# EAGLE design Routerv1.1 (EAGLE 8.3.1)

## Sheet 1 of 2
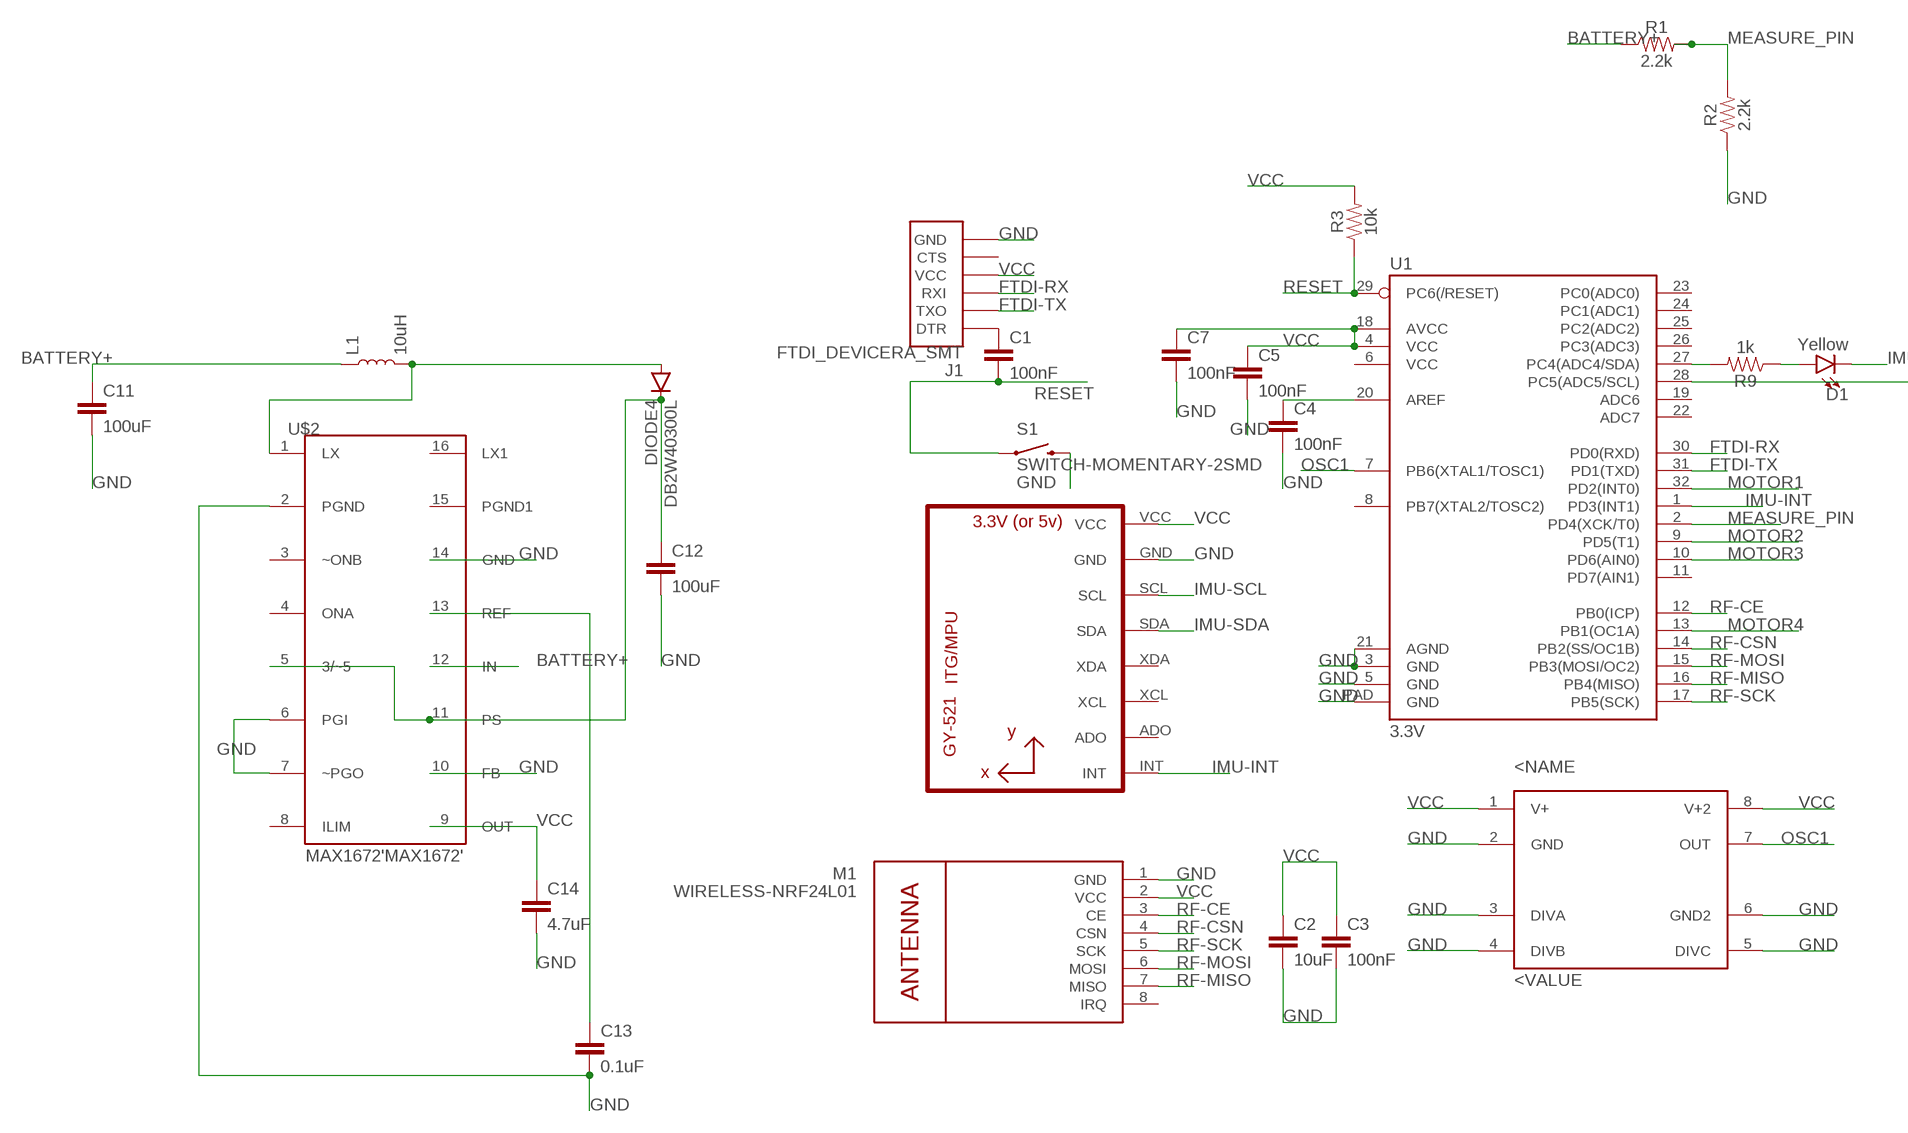
[diagram p0: schematic, sheet 1, part 1 of 2]
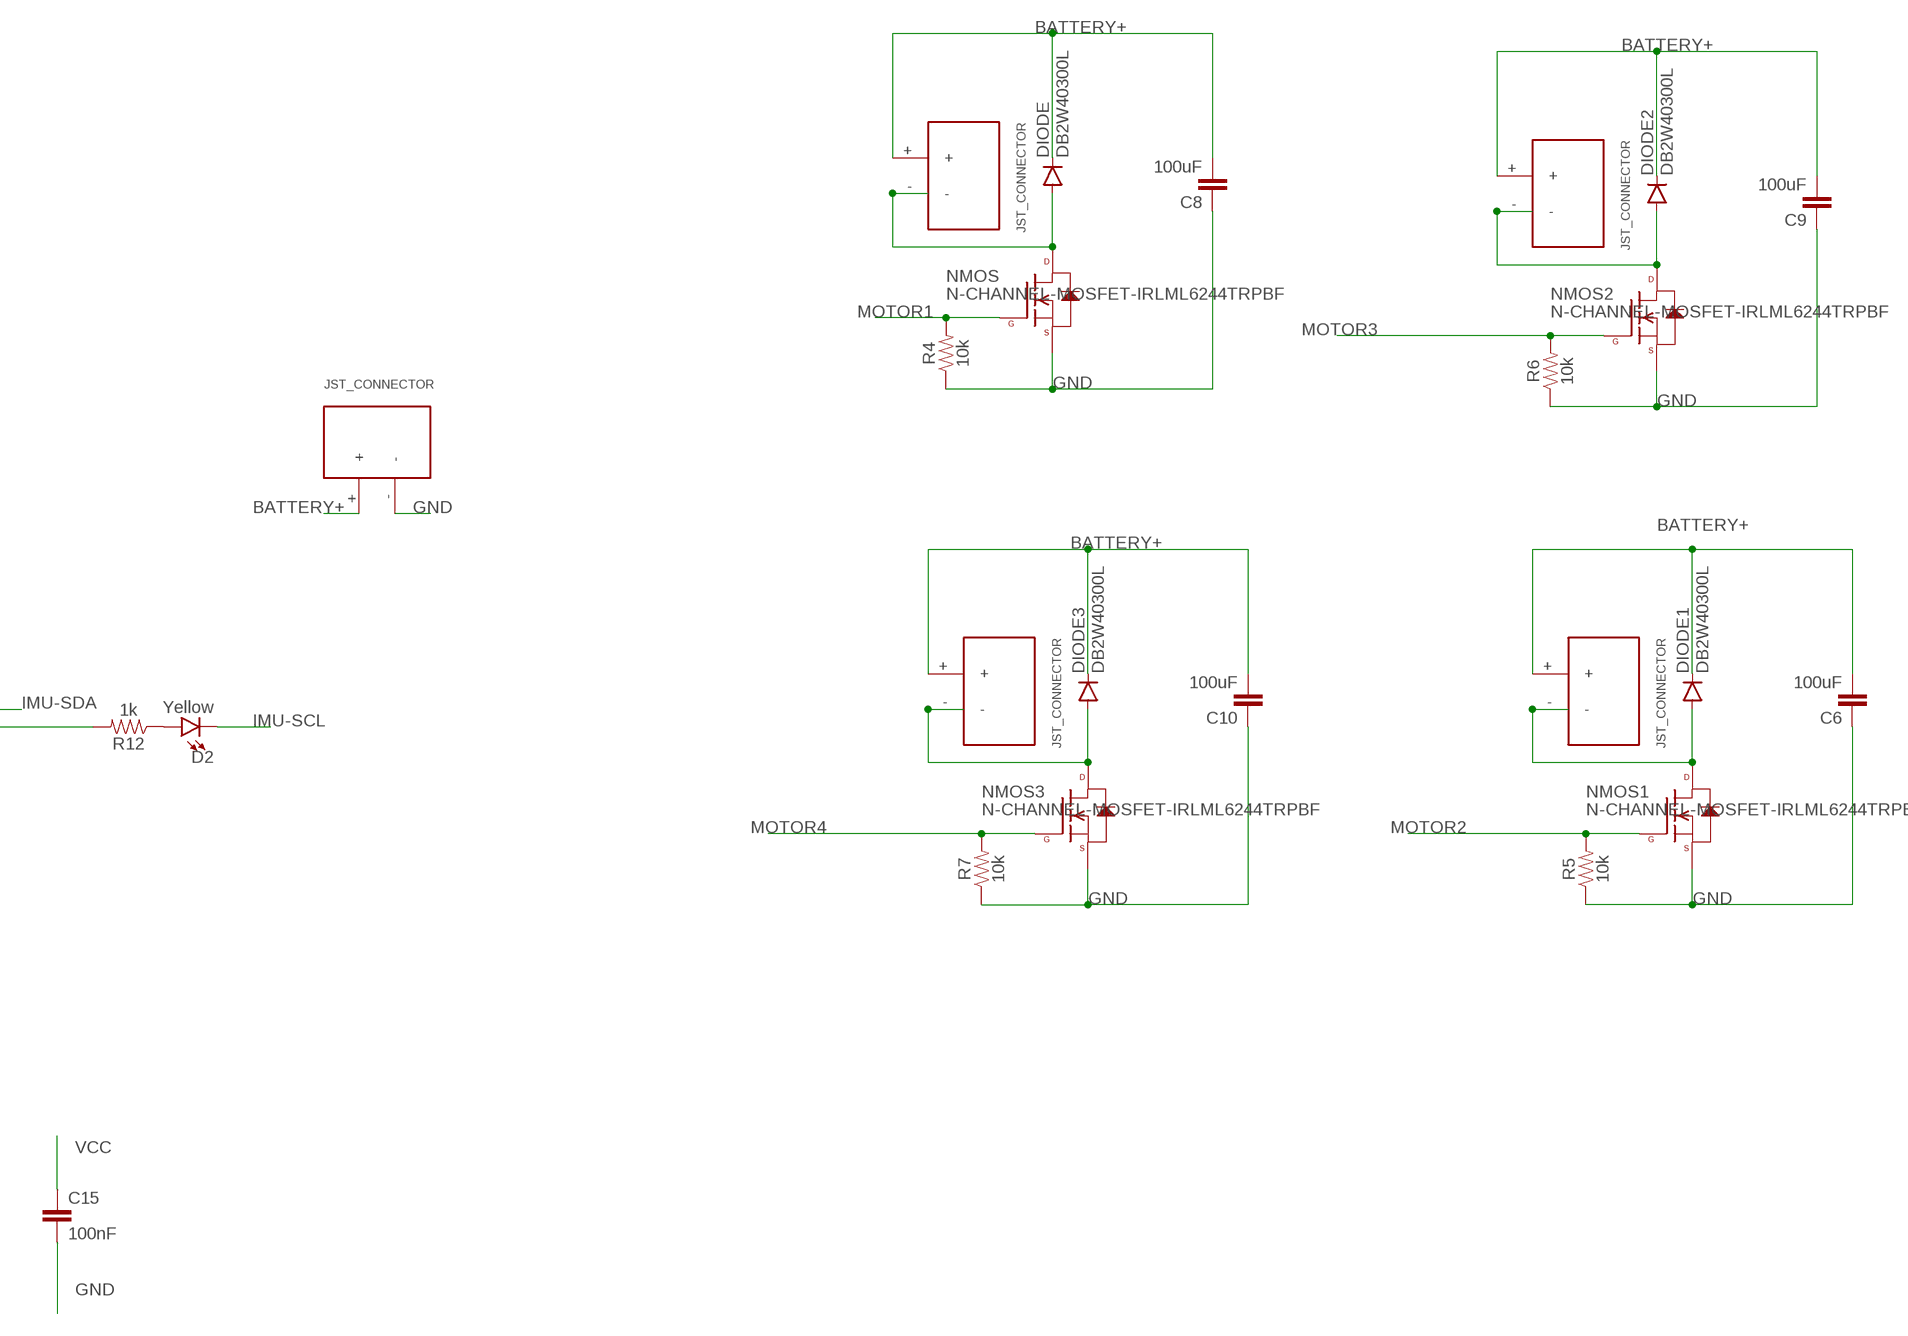
[diagram p1: schematic, sheet 1, part 2 of 2]

### Parts
C1  100nF  0.1UF-25V(+80/-20%)(0603)  [0603-CAP]
C2  10uF  CAP0603-CAP  [0603-CAP]
C3  100nF  CAP0603-CAP  [0603-CAP]
C4  100nF  CAP0603-CAP  [0603-CAP]
C5  100nF  CAP0603-CAP  [0603-CAP]
C6  100uF  CAP0603-CAP  [0603-CAP]
C7  100nF  CAP0603-CAP  [0603-CAP]
C8  100uF  CAP0603-CAP  [0603-CAP]
C9  100uF  CAP0603-CAP  [0603-CAP]
C10  100uF  CAP0603-CAP  [0603-CAP]
C11  100uF  CAP0603-CAP  [0603-CAP]
C12  100uF  CAP0603-CAP  [0603-CAP]
C13  0.1uF  CAP0603-CAP  [0603-CAP]
C14  4.7uF  CAP0603-CAP  [0603-CAP]
C15  100nF  0.1UF-25V(+80/-20%)(0603)  [0603-CAP]
D1  Yellow  LED-YELLOWLILYPAD  [LED-1206]
D2  Yellow  LED-YELLOWLILYPAD  [LED-1206]
DIODE  DB2W40300L  [MINI2-F3-B]
DIODE1  DB2W40300L  [MINI2-F3-B]
DIODE2  DB2W40300L  [MINI2-F3-B]
DIODE3  DB2W40300L  [MINI2-F3-B]
DIODE4  DB2W40300L  [MINI2-F3-B]
J1  FTDI_DEVICERA_SMT  [FTDI_DEVICE_RA_SMT]
L1  10uH  INDUCTOR-0603-33NH  [0603]
M1  WIRELESS-NRF24L01  [WIRELESS-NRF24L01]
MOTOR  JST_CONNECTOR_FEMALE  [JST_CONNECTOR_FEMALE]
MOTOR1  JST_CONNECTOR_FEMALE  [JST_CONNECTOR_FEMALE]
MOTOR2  JST_CONNECTOR_FEMALE  [JST_CONNECTOR_FEMALE]
MOTOR3  JST_CONNECTOR_FEMALE  [JST_CONNECTOR_FEMALE]
NMOS  N-CHANNEL-MOSFET-IRLML6244TRPBF  [SOT23-3]
NMOS1  N-CHANNEL-MOSFET-IRLML6244TRPBF  [SOT23-3]
NMOS2  N-CHANNEL-MOSFET-IRLML6244TRPBF  [SOT23-3]
NMOS3  N-CHANNEL-MOSFET-IRLML6244TRPBF  [SOT23-3]
R1  2.2k  2.2KOHM-0603-1/10W-1%  [0603]
R2  2.2k  2.2KOHM-0603-1/10W-1%  [0603]
R3  10k  2.2KOHM-0603-1/10W-1%  [0603]
R4  10k  2.2KOHM-0603-1/10W-1%  [0603]
R5  10k  2.2KOHM-0603-1/10W-1%  [0603]
R6  10k  2.2KOHM-0603-1/10W-1%  [0603]
R7  10k  2.2KOHM-0603-1/10W-1%  [0603]
R9  1k  2.2KOHM-0603-1/10W-1%  [0603]
R12  1k  2.2KOHM-0603-1/10W-1%  [0603]
S1  SWITCH-MOMENTARY-2SMD  [TACTILE-SWITCH-SMD]
U1  3.3V  ATMEGA328P_MLFMLF32  [MLF32-PAD]
U2  GY-521MPU6050  [GY-521]
U$1  JST_CONNECTOR_FEMALE  [JST_CONNECTOR_FEMALE]
U$2  MAX1672'MAX1672'  [21-0055H_16]
U$3  LTC6930CMS8-8.19LTC6930CMS8-8.19  [SOP65P490X110-8N]

### Nets
BATTERY+: C6.2 C8.2 C9.2 C10.2 C11.1 DIODE1.NEG(GPIN) DIODE2.NEG(GPIN) DIODE3.NEG(GPIN) DIODE.NEG(GPIN) L1.1 MOTOR1.+ MOTOR2.+ MOTOR3.+ MOTOR.+ R1.1 U$1.+ U$2.12(IN)
FTDI-RX: J1.3(RXI) U1.30(PD0(RXD))
FTDI-TX: J1.2(TXO) U1.31(PD1(TXD))
GND: C2.2 C3.2 C4.2 C5.2 C6.1 C7.2 C8.1 C9.1 C10.1 C11.2 C12.2 C13.2 C14.2 C15.2 J1.6(GND) M1.1(GND) NMOS1.2(S) NMOS2.2(S) NMOS3.2(S) NMOS.2(S) R2.1 R4.1 R5.1 R6.1 R7.1 S1.3 U1.3(GND) U1.5(GND) U1.21(AGND) U1.PAD(GND) U2.GND U$1.- U$2.2(PGND) U$2.6(PGI) U$2.7(~PGO) U$2.10(FB) U$2.14(GND) U$3.2(GND) U$3.3(DIVA) U$3.4(DIVB) U$3.5(DIVC) U$3.6(GND2)
IMU-INT: U1.1(PD3(INT1)) U2.INT
IMU-SCL: D2.C U2.SCL
IMU-SDA: D1.C U2.SDA
MEASURE_PIN: R1.2 R2.2 U1.2(PD4(XCK/T0))
MOTOR1: NMOS.1(G) R4.2 U1.32(PD2(INT0))
MOTOR2: NMOS1.1(G) R5.2 U1.9(PD5(T1))
MOTOR3: NMOS2.1(G) R6.2 U1.10(PD6(AIN0))
MOTOR4: NMOS3.1(G) R7.2 U1.13(PB1(OC1A))
N$1: DIODE4.POS(PPIN) L1.2 U$2.1(LX)
N$2: C4.1 U1.20(AREF)
N$3: R9.2 U1.27(PC4(ADC4/SDA))
N$4: DIODE1.POS(PPIN) MOTOR1.- NMOS1.3(D)
N$5: DIODE2.POS(PPIN) MOTOR2.- NMOS2.3(D)
N$6: DIODE.POS(PPIN) MOTOR.- NMOS.3(D)
N$7: DIODE3.POS(PPIN) MOTOR3.- NMOS3.3(D)
N$8: D1.A R9.1
N$9: D2.A R12.1
N$10: R12.2 U1.28(PC5(ADC5/SCL))
N$13: C1.1 J1.1(DTR)
OSC1: U1.7(PB6(XTAL1/TOSC1)) U$3.7(OUT)
RESET: C1.2 R3.1 S1.1 U1.29(PC6(/RESET))
RF-CE: M1.3(CE) U1.12(PB0(ICP))
RF-CSN: M1.4(CSN) U1.14(PB2(SS/OC1B))
RF-MISO: M1.7(MISO) U1.16(PB4(MISO))
RF-MOSI: M1.6(MOSI) U1.15(PB3(MOSI/OC2))
RF-SCK: M1.5(SCK) U1.17(PB5(SCK))
VCC: C2.1 C3.1 C5.1 C7.1 C14.1 C15.1 J1.4(VCC) M1.2(VCC) R3.2 U1.4(VCC) U1.18(AVCC) U2.VCC U$2.9(OUT) U$3.1(V+) U$3.8(V+2)
VR-PS: C12.1 DIODE4.NEG(GPIN) U$2.5(3/~5) U$2.11(PS)
VR-REF: C13.1 U$2.13(REF)
Unconnected: J1.5(CTS) M1.8(IRQ) U1.6(VCC) U1.8(PB7(XTAL2/TOSC2)) U1.11(PD7(AIN1)) U1.19(ADC6) U1.22(ADC7) U1.23(PC0(ADC0)) U1.24(PC1(ADC1)) U1.25(PC2(ADC2)) U1.26(PC3(ADC3)) U2.ADO U2.XCL U2.XDA U$2.3(~ONB) U$2.4(ONA) U$2.8(ILIM) U$2.15(PGND1) U$2.16(LX1)

## Sheet 2 of 2

## Library data of the parts
C1 C15 = SparkFun-Capacitors:0.1UF-25V(+80/-20%)(0603): CAP-00810 Ceramic Standard decoupling cap; PROD_ID: CAP-00810; VALUE: 0.1uF
C2-C14 = SparkFun-Passives:CAP: Capacitor Standard 0603 ceramic capacitor, and 0.1" leaded capacitor.
D1 D2 = SparkFun-LED:LED-YELLOW: Yellow SMD LED Used in manufacturing several products at SparkFun. Packages: 0603 - SMD 0603 package[Product Link] <http://www.kingbrightusa.com/product.asp?catalog_name=LED&product_id=APT1608SYCK> 0603 -SMART - SMART SMD 0603 package (more efficient/more expensive) [Product Link] <http://www.osram-os.com/osram_os/en/products/product-catalog/led-light-emitting-diodes/smartled-0603/ly-l29k/index.jsp> LilyPad - SMD1206 package[Product Datasheet] <https://www.sparkfun.com/datasheets/DevTools/LilyPad/Q150YUS4.pdf> SparkFun Products: Blynk Board <https://www.sparkfun.com/products/13794> IOIO-OTG <https://www.sparkfun.com/products/13613> XBee Explorer Serial <https://www.sparkfun.com/products/13225>; PROD_ID: DIO-09909
DIODE DIODE1-DIODE4 = quad:DB2W40300L
J1 = quad:FTDI_DEVICE: Connector which mates to FTDI basic or FTDI cable.; PROD_ID: CONN-08971
L1 = SparkFun-Coils:INDUCTOR: Inductors Resist changes in electrical current. Basically a coil of wire. SparkFun Products: SparkFun Load Cell Amplifier - HX711 <https://www.sparkfun.com/products/13879> IOIO-OTG - V2.2 <https://www.sparkfun.com/products/13613>; PROD_ID: NDUC-07874; VALUE: 33nH/±5%/500mA
M1 = quad:WIRELESS-NRF24L01: 2.4 GHz Wireless Module based on NRF24L01 chip
MOTOR MOTOR1-MOTOR3 U$1 = quad:JST_CONNECTOR_FEMALE
NMOS NMOS1-NMOS3 = quad:N-CHANNEL-MOSFET: N-Channel MOSFET Mode Field Effect Transistor; DATASHEET: http://www.mouser.com/ds/2/196/irlml6244pbf-936666.pdf; MOUSER: 942-IRLML6244TRPBF; URL: http://www.mouser.com/Search/ProductDetail.aspx?R=IRLML6244TRPBFvirtualkey57370000virtualkey942-IRLML6244TRPBF
R1 R2 = SparkFun-Resistors:2.2KOHM: 2.2kΩ resistor A resistor is a passive two-terminal electrical component that implements electrical resistance as a circuit element. Resistors act to reduce current flow, and, at the same time, act to lower voltage levels within circuits. - Wikipedia; PROD_ID: RES-08272
R3-R7 R9 R12 = SparkFun-Resistors:2.2KOHM: 2.2kΩ resistor A resistor is a passive two-terminal electrical component that implements electrical resistance as a circuit element. Resistors act to reduce current flow, and, at the same time, act to lower voltage levels within circuits. - Wikipedia; PROD_ID: RES-08272; VALUE: 2.2k
S1 = quad:SWITCH-MOMENTARY-2: Various NO switches- pushbuttons, reed, etc; PROD_ID: SWCH-08247
U1 = SparkFun-DigitalIC:ATMEGA328P_MLF: 32-Pin Atmega328 part Commonly used on Arduino compatible boards Available in QFP and QFN packages TQFP is IC-09069 QFN is non-stock
U2 = quad:GY-521
U$2 = voltreg:MAX1672
U$3 = LTC6390:LTC6930CMS8-8.19

## Net classes
1 BATTERY_+: width 0.762 mm
2 VCC: width 0.762 mm
3 GND: width 0.762 mm

## Board
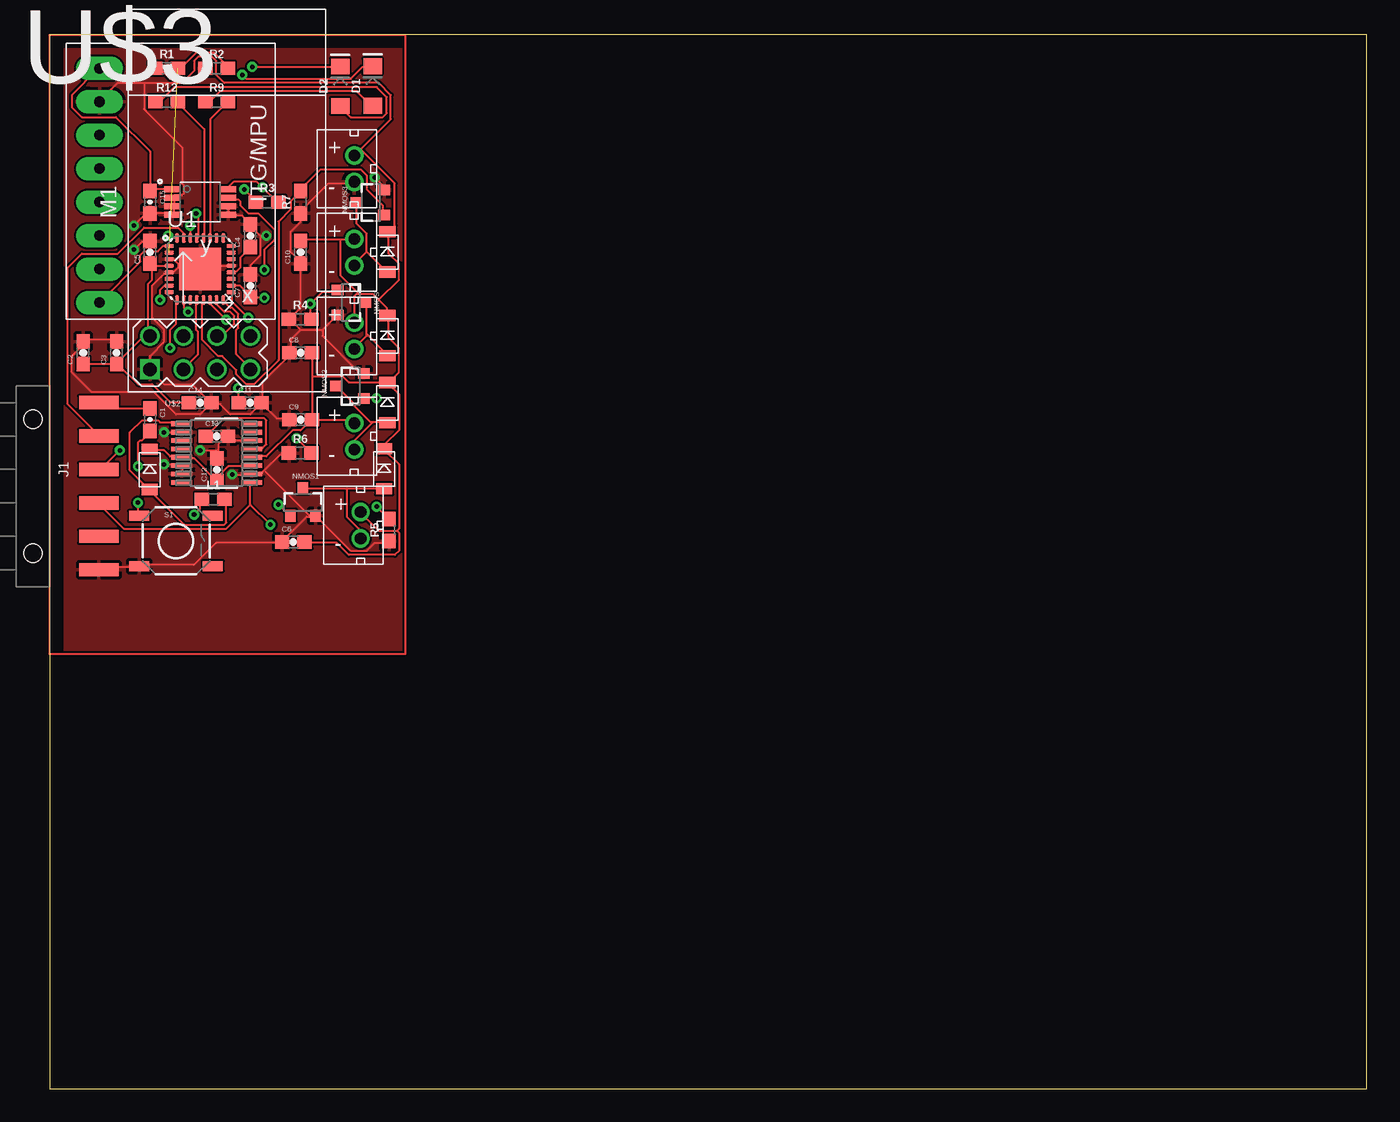
[diagram p2: board, top side]
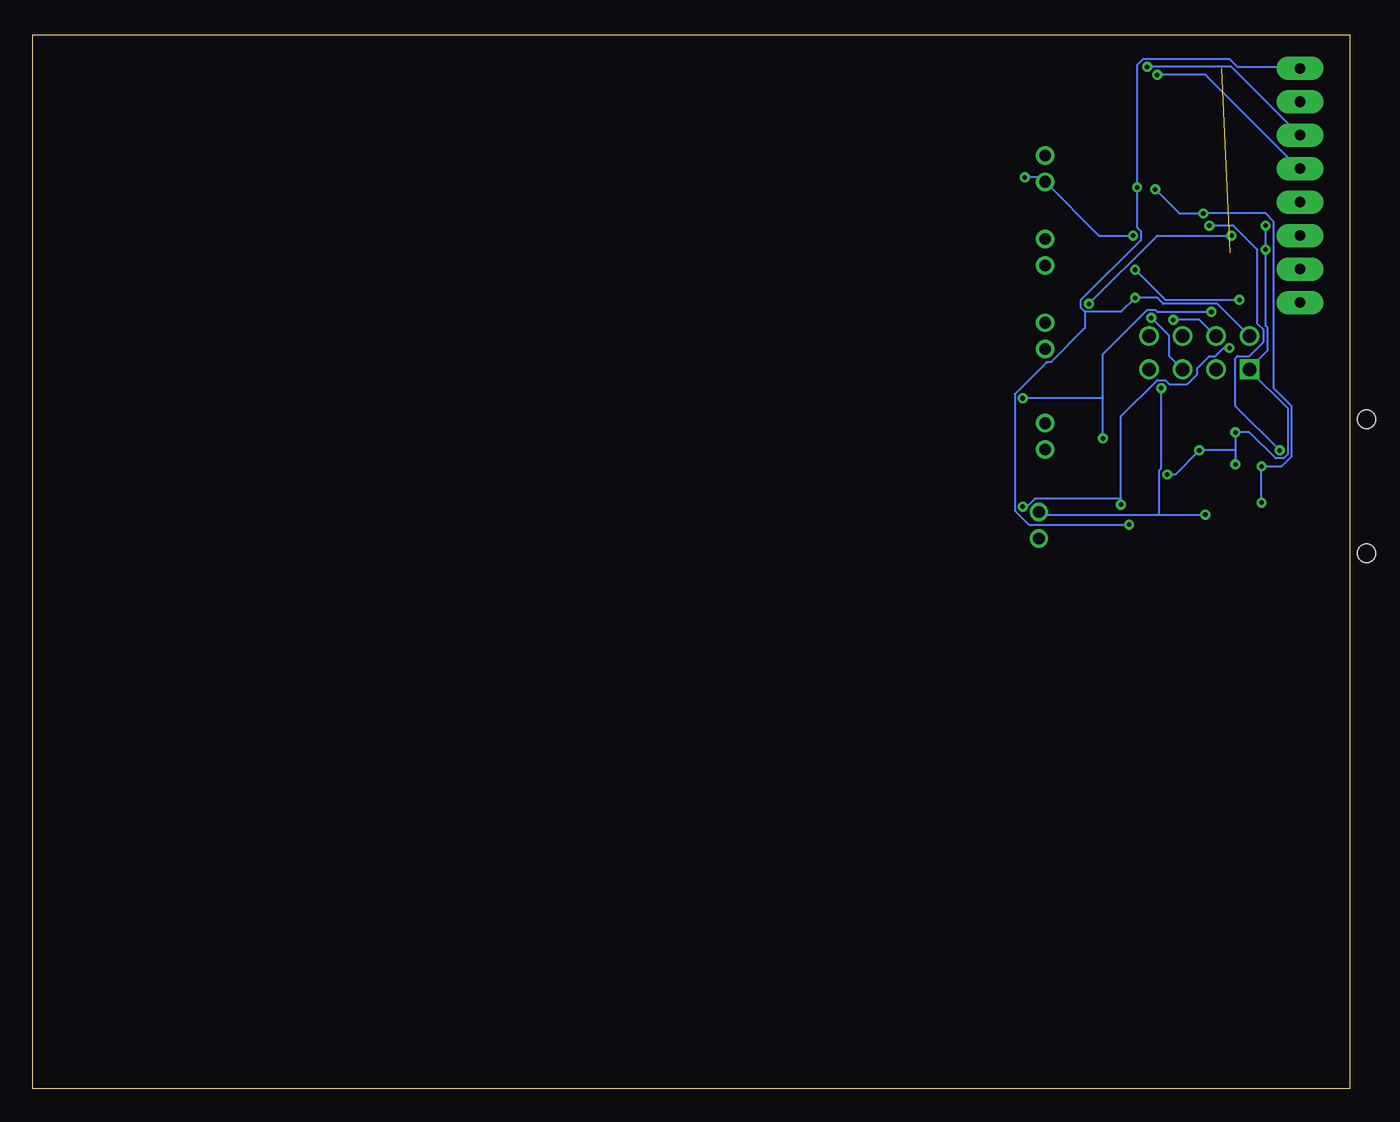
[diagram p3: board, bottom side, seen from below]

Size 100 x 80 mm. Coordinates in mm from the lower left corner, seen from the top.
Outline: 0,0 100,0 100,80 0,80 0,0
Copper layers (1*16): Top 0.035mm / dielectric 1.5mm / Bottom 0.035mm
Design rules "default": minimum track width 6mil, minimum drill 0.35mm, track to track 6mil, track to pad 6mil, pad to pad 6mil, via to via 6mil, smd to smd 6mil, copper to edge 40mil, drill to drill 6mil, minimum pad ring 10mil, minimum via ring 8mil, stop-mask expansion 4mil, vias tented up to drill 0mil, thermal gap 10mil

### Footprints (pad centres in the part's own frame; a part is rotated, then mirrored left to right if it is on the bottom)
0603-CAP = smd 1.1 x 1: 1 -0.85,0; 2 0.85,0
LED-1206 = smd 1.2 x 1.4: A -1.5,0; C 1.5,0
MINI2-F3-B = smd 1.22 x 0.85: NEG 0,1.55; POS 0,-1.5
FTDI_DEVICE_RA_SMT = smd 1 x 3: 1 -6.35,5; 2 -3.81,5; 3 -1.27,5; 4 1.27,5; 5 3.81,5; 6 6.35,5 | hole 1.4: -5.08,0; 5.08,0
0603 = smd 1.1 x 1: 1 -0.85,0; 2 0.85,0
WIRELESS-NRF24L01 = drill 1 square: 1 -12.7,6.35 | drill 1: 2 -10.16,6.35; 3 -12.7,3.81; 4 -10.16,3.81; 5 -12.7,1.27; 6 -10.16,1.27; 7 -12.7,-1.27; 8 -10.16,-1.27
JST_CONNECTOR_FEMALE = drill 0.889: + 0,1; - 0,-1
SOT23-3 = smd 0.8 x 0.9: 1 -0.95,-1; 2 0.95,-1; 3 0,1.1
TACTILE-SWITCH-SMD = smd 1.524 x 0.762: 1 -2.794,1.905; 2 2.794,1.905; 3 -2.794,-1.905; 4 2.794,-1.905
MLF32-PAD = smd 0.7 x 0.3: 1 -2.35,1.75; 2 -2.35,1.25; 3 -2.35,0.75; 4 -2.35,0.25; 5 -2.35,-0.25; 6 -2.35,-0.75; 7 -2.35,-1.25; 8 -2.35,-1.75; 17 2.35,-1.75; 18 2.35,-1.25; 19 2.35,-0.75; 20 2.35,-0.25; 21 2.35,0.25; 22 2.35,0.75; 23 2.35,1.25; 24 2.35,1.75 | smd 0.3 x 0.7: 9 -1.75,-2.35; 10 -1.25,-2.35; 11 -0.75,-2.35; 12 -0.25,-2.35; 13 0.25,-2.35; 14 0.75,-2.35; 15 1.25,-2.35; 16 1.75,-2.35; 25 1.75,2.35; 26 1.25,2.35; 27 0.75,2.35; 28 0.25,2.35; 29 -0.25,2.35; 30 -0.75,2.35; 31 -1.25,2.35; 32 -1.75,2.35 | smd 3.2 x 3.2: PAD 0,0
GY-521 = drill 0.8 pad 1.778 long: ADO -8.89,-6.35; GND -8.89,6.35; INT -8.89,-8.89; SCL -8.89,3.81; SDA -8.89,1.27; VCC -8.89,8.89; XCL -8.89,-3.81; XDA -8.89,-1.27
21-0055H_16 = smd 1.6 x 0.356: 1 -2.654,2.223; 2 -2.654,1.587; 3 -2.654,0.953; 4 -2.654,0.318; 5 -2.654,-0.318; 6 -2.654,-0.953; 7 -2.654,-1.587; 8 -2.654,-2.223; 9 2.654,-2.223; 10 2.654,-1.587; 11 2.654,-0.953; 12 2.654,-0.318; 13 2.654,0.318; 14 2.654,0.953; 15 2.654,1.587; 16 2.654,2.223
SOP65P490X110-8N = smd 1.25 x 0.46: 1 -2.11,0.975; 2 -2.11,0.325; 3 -2.11,-0.325; 4 -2.11,-0.975; 5 2.11,-0.975; 6 2.11,-0.325; 7 2.11,0.325; 8 2.11,0.975

### Placement (x,y rotation side)
C1  7.62,50.8 270 top
C2  2.54,55.88 90 top
C3  5.08,55.88 90 top
C4  15.24,64.77 90 top
C5  7.62,63.5 90 top
C6  18.5,41.51 0 top
C7  15.24,60.96 90 top
C8  19.05,55.88 0 top
C9  19.05,50.8 0 top
C10  19.05,63.5 90 top
C11  15.21,52.07 0 top
C12  12.7,46.99 90 top
C13  12.7,49.53 0 top
C14  11.43,52.07 0 top
C15  7.62,67.31 270 top
D1  24.53,76.13 90 top
D2  22.07,76.1 90 top
DIODE  25.64,57.15 0 top
DIODE1  25.39,47.05 0 top
DIODE2  25.64,52.07 0 top
DIODE3  25.64,63.5 0 top
DIODE4  7.59,46.99 0 top
J1  -1.27,45.75 270 top
L1  12.43,44.75 0 top
M1  13.97,67.31 90 top
MOTOR  23.13,57.15 0 top
MOTOR1  23.61,42.78 0 top
MOTOR2  23.13,49.53 0 top
MOTOR3  23.13,63.5 0 top
NMOS  22.86,59.69 270 top
NMOS1  19.23,44.51 0 top
NMOS2  22.86,53.34 90 top
NMOS3  24.4,67.28 90 top
R1  8.89,77.47 0 top
R2  12.67,77.47 0 top
R3  16.51,67.31 0 top
R4  19.02,58.42 0 top
R5  25.76,42.42 90 top
R6  19.02,48.26 0 top
R7  19.05,67.31 90 top
R9  12.67,74.93 0 top
R12  8.89,74.93 0 top
S1  9.59,41.59 0 top
U1  11.43,62.23 0 top
U2  12.67,68.58 0 top
U$1  23.13,69.85 0 top
U$2  12.67,48.26 0 top
U$3  11.43,67.31 0 top

### Tracks (layer width: path | path; a pad name or v marks a point on that pad's centre or on a via)
BATTERY+  (via drill 0.35)
  Top 0.152: v10.97,43.59 11.43,44.04 11.43,44.65 L1.1 | 26.36,42.37 26.52,42.22 26.52,40.84 26.21,40.54 22.71,40.54 21.79,41.45 19.36,41.45 C6.2 | 26.36,42.37 24.99,42.37 23.62,43.74 MOTOR1.+ | v14.33,53.19 14.33,52.12 C11.1 | 23.62,71.32 23.16,70.87 U$1.+ 23.62,71.32 | 23.62,71.32 25.91,73.61 25.91,75.44 24.99,76.35 13.26,76.35 12.65,76.96 12.65,78.03 12.34,78.33 11.28,78.33 10.97,78.03 10.97,77.27 10.36,76.66 9.14,76.66 8.38,77.42 8.08,77.42 R1.1 | 22.1,64.47 23.01,64.47 MOTOR3.+ | 22.1,64.47 19.05,64.47 C10.2 | 24.99,59.89 24.54,60.35 23.47,60.35 | 24.99,59.89 25.6,59.28 25.6,58.83 DIODE.NEG 25.76,58.67 25.76,57 26.52,56.24 26.52,54.41 25.76,53.65 DIODE2.NEG | 23.47,60.35 23.32,60.35 23.16,60.2 23.16,58.22 MOTOR.+ | 24.99,59.89 26.52,61.42 26.52,62.64 25.76,63.4 25.76,64.92 DIODE3.NEG 25.76,65.08 26.21,65.53 26.21,68.73 23.62,71.32 | 22.1,64.47 22.1,61.72 23.47,60.35 | DIODE2.NEG 25.76,53.49 26.52,52.73 26.52,49.99 25.45,48.92 25.45,48.62 DIODE1.NEG 25.45,48.46 26.52,47.4 26.52,42.52 26.36,42.37 | C9.2 19.96,50.75 22.86,50.75 23.01,50.6 MOTOR2.+ | 19.96,54.1 19.96,50.9 C9.2 | 19.96,54.1 19.96,55.78 C8.2 | U$2.12 15.39,48.01 16.46,48.01 18.44,49.99 19.05,49.99 19.81,50.75 C9.2 | 19.96,54.1 22.25,54.1 22.71,53.65 25.6,53.65 DIODE2.NEG
  Bottom 0.152: 14.48,43.59 23.32,43.59 23.47,43.74 MOTOR1.+ | 14.48,43.59 v10.97,43.59 | v14.33,53.19 14.33,47.09 14.48,46.94 14.48,43.59
FTDI-RX  (via drill 0.35)
  Top 0.152: v10.67,65.53 10.67,64.62 U1.30 | v5.33,48.46 3.81,46.94 J1.3
  Bottom 0.152: v10.67,65.53 8.84,65.53 7.01,63.7 7.01,58.06 6.55,57.61 6.55,56.69 7.62,55.63 8.53,55.63 8.69,55.47 8.69,51.82 v5.33,48.46
FTDI-TX
  Top 0.152: U1.31 10.21,64.62 10.21,64.92 9.75,65.38 7.16,65.38 5.18,63.4 2.44,63.4 1.37,62.33 1.37,51.97 3.66,49.68 J1.2
GND  (via drill 0.35)
  Top 0.152: 10.05,68.73 10.04,68.74 9.97,68.74 | 10.05,68.73 10.17,68.61 10.17,67.96 10.04,67.83 9.51,67.83 U$3.2 9.45,67.51 9.45,67.06 U$3.3 9.45,66.9 9.45,66.45 U$3.4 9.3,66.45 7.62,66.45 | C3.2 5.03,56.84 2.59,56.84 C2.2 2.44,56.69 2.44,56.39 1.68,55.63 1.68,54.41 3.2,52.88 7.92,52.88 9.6,51.21 11.43,51.21 12.19,51.97 C14.2 | C14.2 12.34,51.97 12.95,51.97 13.72,51.21 15.24,51.21 16,51.97 C11.2 | C9.1 18.14,50.9 17.22,50.9 16.15,51.97 C11.2 | U$3.6 13.56,66.9 13.56,66.45 U$3.5 13.56,66.29 14.63,66.29 15.24,65.68 C4.2 15.24,65.53 16,64.77 | C7.2 15.24,62.48 16,63.25 16,64.77 | v24.69,69.19 25.3,68.58 25.3,68.28 NMOS3.2 | 20.73,57.61 21.79,58.67 NMOS.2 | 19.05,57.61 20.73,57.61 | 19.05,57.61 18.29,58.37 R4.1 18.29,58.52 19.05,59.28 C10.1 19.05,62.79 18.29,63.55 18.29,65.08 19.05,65.84 R7.1 19.05,66.6 21.18,68.73 23.01,68.73 U$1.- | 20.73,57.61 20.73,57.15 23.47,54.41 23.77,54.41 NMOS2.2 | 19.05,57.61 18.29,56.84 18.29,55.93 C8.1 18.29,55.78 16.15,53.65 16.15,52.12 C11.2 | v16.46,64.77 16,64.77 | J1.6 3.81,39.47 3.96,39.62 6.71,39.62 S1.3 6.86,39.78 10.97,39.78 12.65,41.45 17.53,41.45 C6.1 17.68,41.6 19.51,43.43 19.81,43.43 | 16.31,46.94 16.15,46.79 15.39,46.79 U$2.10 15.24,46.63 v13.87,46.63 | 16.31,46.94 17.53,48.16 18.14,48.16 R6.1 | 19.81,43.43 20.12,43.43 NMOS1.2 | R5.1 25.76,41.45 24.69,41.45 24.08,40.84 22.86,40.84 20.27,43.43 NMOS1.2 | 19.81,43.43 16.31,46.94 | 19.81,43.43 NMOS1.2 | 7.16,76.35 5.18,76.35 3.81,74.98 U2.GND | 7.16,76.35 10.67,76.35 11.73,77.42 R2.1 | 7.16,76.35 7.16,74.37 10.06,71.48 10.06,68.73 10.05,68.73 | 9.75,62.33 9.45,62.03 9.14,62.03 U1.5 8.99,61.87 8.69,61.87 7.77,60.96 7.77,58.52 8.69,57.61 8.69,56.69 7.62,55.63 M1.1 7.62,54.56 8.69,53.49 10.82,53.49 12.19,52.12 C14.2
  Top 0.152: 9.75,62.33 9.75,62.64 9.45,62.94 9.14,62.94 U1.3 | 11.43,62.33 11.58,62.48 13.72,62.48 U1.21 | 11.43,62.33 9.75,62.33 | 11.43,62.33 U1.PAD | 12.8,48.46 12.8,48.92 13.41,49.53 C13.2 13.56,49.53 13.87,49.23 15.24,49.23 U$2.14 | 12.8,48.46 12.8,47.85 C12.2 | U$2.7 10.06,46.79 10.06,47.24 U$2.6 9.91,47.4 v8.69,47.4 | v6.4,63.7 7.01,64.31 7.62,64.31 C5.2 | v8.69,49.84 9.91,49.84 U$2.2 | v11.43,48.46 12.8,48.46 | 7.62,66.45 7.32,66.45 v6.4,65.53 | 7.62,66.45 C15.2
  Bottom 0.152: v24.69,69.19 23.47,69.19 U$1.- 19.05,64.77 v16.46,64.77 | 8.69,48.46 v8.69,49.84 7.62,49.84 5.64,47.85 5.03,47.85 4.72,48.16 4.72,51.66 7.62,54.56 M1.1 7.62,54.71 6.25,56.08 6.25,57.76 6.4,57.91 v6.4,63.7 v6.4,65.53 | 8.69,48.46 v8.69,47.4 | 8.69,48.46 v11.43,48.46 13.26,46.63 v13.87,46.63
  pour Top: 0,81 28,81 28,32 -1,32 -2,33 -2,79
IMU-INT
  Top 0.152: U2.INT 6.89,62.8 6.89,63.3 7.17,63.57 8.21,63.57 8.62,63.98 U1.1
IMU-SCL  (via drill 0.35)
  Top 0.152: v15.39,77.57 21.95,77.57 D2.C
  Bottom 0.152: v15.39,77.57 8.99,77.57 3.81,72.39 U2.SCL
IMU-SDA  (via drill 0.35)
  Top 0.152: v14.63,76.96 14.94,76.66 22.86,76.66 23.77,77.57 24.38,77.57 D1.C
  Bottom 0.152: v14.63,76.96 10.97,76.96 3.81,69.8 U2.SDA
MEASURE_PIN  (1 unrouted)
  Top 0.152: R1.2 9.75,77.57 10.06,77.57 11.12,78.64 12.5,78.64 13.56,77.57 R2.2
MOTOR1  (via drill 0.35)
  Top 0.152: v8.99,64.77 9.14,64.62 9.6,64.62 U1.32 | R4.2 19.81,58.52 v19.81,59.59 20.73,60.5 21.79,60.5 NMOS.1
  Bottom 0.152: v8.99,64.77 14.63,64.77 v19.81,59.59
MOTOR2  (via drill 0.35)
  Top 0.152: v9.14,56.24 9.14,57.61 9.6,58.06 9.6,59.74 U1.9 | v17.37,44.35 18.14,43.59 NMOS1.1 | v24.84,44.2 25.76,43.28 R5.2
  Bottom 0.152: v9.14,56.24 9.6,56.24 10.21,55.63 10.67,55.63 11.58,54.71 11.58,54.25 12.34,53.49 13.72,53.49 14.02,53.8 14.63,53.8 17.37,51.05 17.37,44.81 | v17.37,44.35 17.37,44.81 | v24.84,44.2 24.54,44.2 23.93,44.81 17.37,44.81
MOTOR3  (via drill 0.35)
  Top 0.152: v10.52,58.98 10.21,59.28 10.21,59.74 U1.10 | v18.75,49.38 19.81,48.31 R6.2 | v24.84,52.43 23.93,52.43 NMOS2.1
  Bottom 0.152: v10.52,58.98 14.63,58.98 14.78,59.13 15.39,59.13 18.75,55.78 18.75,52.43 | v18.75,49.38 18.75,52.43 | 18.75,52.43 v24.84,52.43
MOTOR4
  Top 0.152: U1.13 11.58,59.74 11.58,56.84 12.8,55.63 13.11,55.63 14.17,54.56 14.17,54.25 14.94,53.49 15.54,53.49 17.37,55.32 17.37,65.84 18.29,66.75 18.29,67.36 19.05,68.12 R7.2 19.05,68.28 20.57,69.8 23.62,69.8 24.08,69.34 24.08,68.28 25.3,67.06 25.3,66.45 NMOS3.1
N$1
  Top 0.152: L1.2 13.41,44.65 13.41,42.98 13.26,42.82 10.21,42.82 7.62,45.41 DIODE4.POS 7.47,45.57 6.1,46.94 6.1,49.84 7.01,50.75 8.23,50.75 8.38,50.6 9.91,50.6 U$2.1
N$2
  Top 0.152: U1.20 13.87,62.03 14.17,62.03 14.48,62.33 14.48,63.09 15.24,63.86 C4.1
N$3
  Top 0.152: U1.27 12.19,64.62 12.19,73.61 13.41,74.83 R9.2
N$4
  Top 0.152: 22.55,45.57 25.3,45.57 DIODE1.POS | 22.55,45.57 19.36,45.57 NMOS1.3 | 22.55,45.57 22.55,43.43 23.47,42.52 23.47,41.91 MOTOR1.-
N$5
  Top 0.152: 24.54,50.6 25.6,50.6 DIODE2.POS | 24.54,50.6 24.38,50.6 23.16,51.82 23.16,51.97 21.79,53.34 NMOS2.3 | 24.54,50.6 23.16,49.23 23.16,48.62 MOTOR2.-
N$6
  Top 0.152: 24.08,57.3 24.08,57.15 23.16,56.24 MOTOR.- | 24.08,57.3 24.08,59.59 NMOS.3 | 24.08,57.3 25.6,55.78 DIODE.POS
N$7
  Top 0.152: 24.08,63.55 24.08,64.92 23.32,65.68 23.32,67.21 NMOS3.3 | 24.08,63.55 23.16,62.64 MOTOR3.- | 24.08,63.55 25.6,62.03 DIODE3.POS
N$8
  Top 0.152: R9.1 11.89,74.98 12.19,74.98 12.95,75.74 23.32,75.74 24.38,74.68 D1.A
N$9
  Top 0.152: R12.1 8.08,74.98 8.38,74.98 9.45,76.05 24.84,76.05 25.6,75.29 25.6,74.07 25.3,73.76 22.86,73.76 22.1,74.52 D2.A
N$10
  Top 0.152: U1.28 11.73,64.62 11.73,72.85 9.75,74.83 R12.2
N$11
  Top 0.152: 27,80 27,33 0,33 0,80 27,80
N$13
  Top 0.152: C1.1 7.62,51.66 4.12,51.66 3.81,51.97 J1.1
OSC1  (via drill 0.35)
  Top 0.152: v8.38,59.89 8.38,60.66 8.69,60.96 8.99,60.96 U1.7 | v16.31,62.18 16.31,63.7 17.07,64.47 17.07,65.23 15.85,66.45 15.09,66.45 14.48,67.06 14.48,67.36 14.33,67.51 13.56,67.51 U$3.7
  Bottom 0.152: v8.38,59.89 14.02,59.89 v16.31,62.18
RESET  (via drill 0.35)
  Top 0.152: v11.12,66.45 11.28,66.29 11.28,64.62 U1.29 | v14.78,68.28 15.7,67.36 R3.1 | v6.71,47.24 6.71,49.07 6.86,49.23 7.01,49.23 7.62,49.84 C1.2 | v6.71,44.5 6.71,43.59 S1.1
  Bottom 0.152: v14.78,68.28 12.95,66.45 v11.12,66.45 6.4,66.45 5.79,65.84 5.79,53.19 4.42,51.82 4.42,48.01 5.18,47.24 v6.71,47.24 v6.71,44.5
RF-CE
  Top 0.152: U1.12 11.12,59.74 11.12,57.61 11.28,57.45 11.28,55.78 10.21,54.71 M1.3
RF-CSN  (via drill 0.35)
  Top 0.152: v13.41,58.37 12.19,59.59 12.19,59.74 U1.14
  Bottom 0.152: v13.41,58.37 11.43,58.37 10.21,57.15 M1.4
RF-MISO
  Top 0.152: U1.16 13.26,59.74 13.72,59.28 13.87,59.28 14.33,58.83 14.33,57.76 14.17,57.61 14.17,55.78 15.24,54.71 M1.7
RF-MOSI
  Top 0.152: M1.6 13.11,57.15 14.02,58.06 14.02,58.67 13.72,58.98 13.26,58.98 12.65,59.59 12.65,59.74 U1.15
RF-SCK  (via drill 0.35)
  Top 0.152: v15.09,58.52 13.87,59.74 13.87,60.35 U1.17
  Bottom 0.152: v15.09,58.52 13.72,57.15 13.72,55.63 M1.5
VCC  (via drill 0.35)
  Top 0.152: 7.62,68.28 9.3,68.28 U$3.1 | 7.62,68.28 7.62,71.17 5.03,73.76 2.44,73.76 1.68,74.52 1.68,75.44 3.66,77.42 U2.VCC | 7.62,68.28 C15.1 | 15.24,44.35 15.24,46.02 U$2.9 | 15.24,44.35 13.41,42.52 5.64,42.52 3.81,44.35 J1.4 | C2.1 2.59,55.02 5.03,55.02 C3.1 | C14.1 10.52,52.12 9.14,52.12 7.77,53.49 6.71,53.49 5.18,55.02 C3.1 | R3.2 17.22,67.36 v16.15,68.43 15.7,68.89 14.02,68.89 13.56,68.43 U$3.8 | U1.18 13.87,60.96 14.48,60.96 15.24,60.2 C7.1 15.24,60.05 v16.31,60.05 | 7.77,62.48 8.99,62.48 U1.4 | 7.77,62.48 7.62,62.64 C5.1 7.77,62.48 | 7.77,62.48 7.77,61.42 7.47,61.11 7.47,57.45 | 7.47,57.45 7.47,57.3 M1.2 7.47,57.45 | 7.47,57.45 5.18,55.17 C3.1 | v16.76,42.82 15.24,44.35
  Bottom 0.152: M1.2 10.06,59.59 14.17,59.59 14.63,60.05 v16.31,60.05 17.37,58.98 20.12,58.98 | 20.12,58.98 20.42,59.28 20.42,59.89 15.85,64.47 15.85,65.08 16.15,65.38 v16.15,68.43 16.15,77.72 15.7,78.18 9.14,78.18 8.53,77.57 3.81,77.57 U2.VCC | v16.76,42.82 24.38,42.82 25.45,43.89 25.45,52.73 23.01,55.17 22.71,55.17 20.12,57.76 20.12,58.98
VR-PS
  Top 0.152: DIODE4.NEG 7.62,48.46 8.69,48.46 9.14,48.01 9.91,48.01 U$2.5 10.06,47.85 10.97,47.85 12.65,46.18 C12.1 12.8,46.18 12.8,46.48 13.56,47.24 15.24,47.24 U$2.11
VR-REF
  Top 0.152: C13.1 11.89,49.53 13.26,50.9 16.31,50.9 16.46,50.75 16.46,48.92 16.15,48.62 15.39,48.62 U$2.13